# EAGLE design motherboard (EAGLE 6.4)
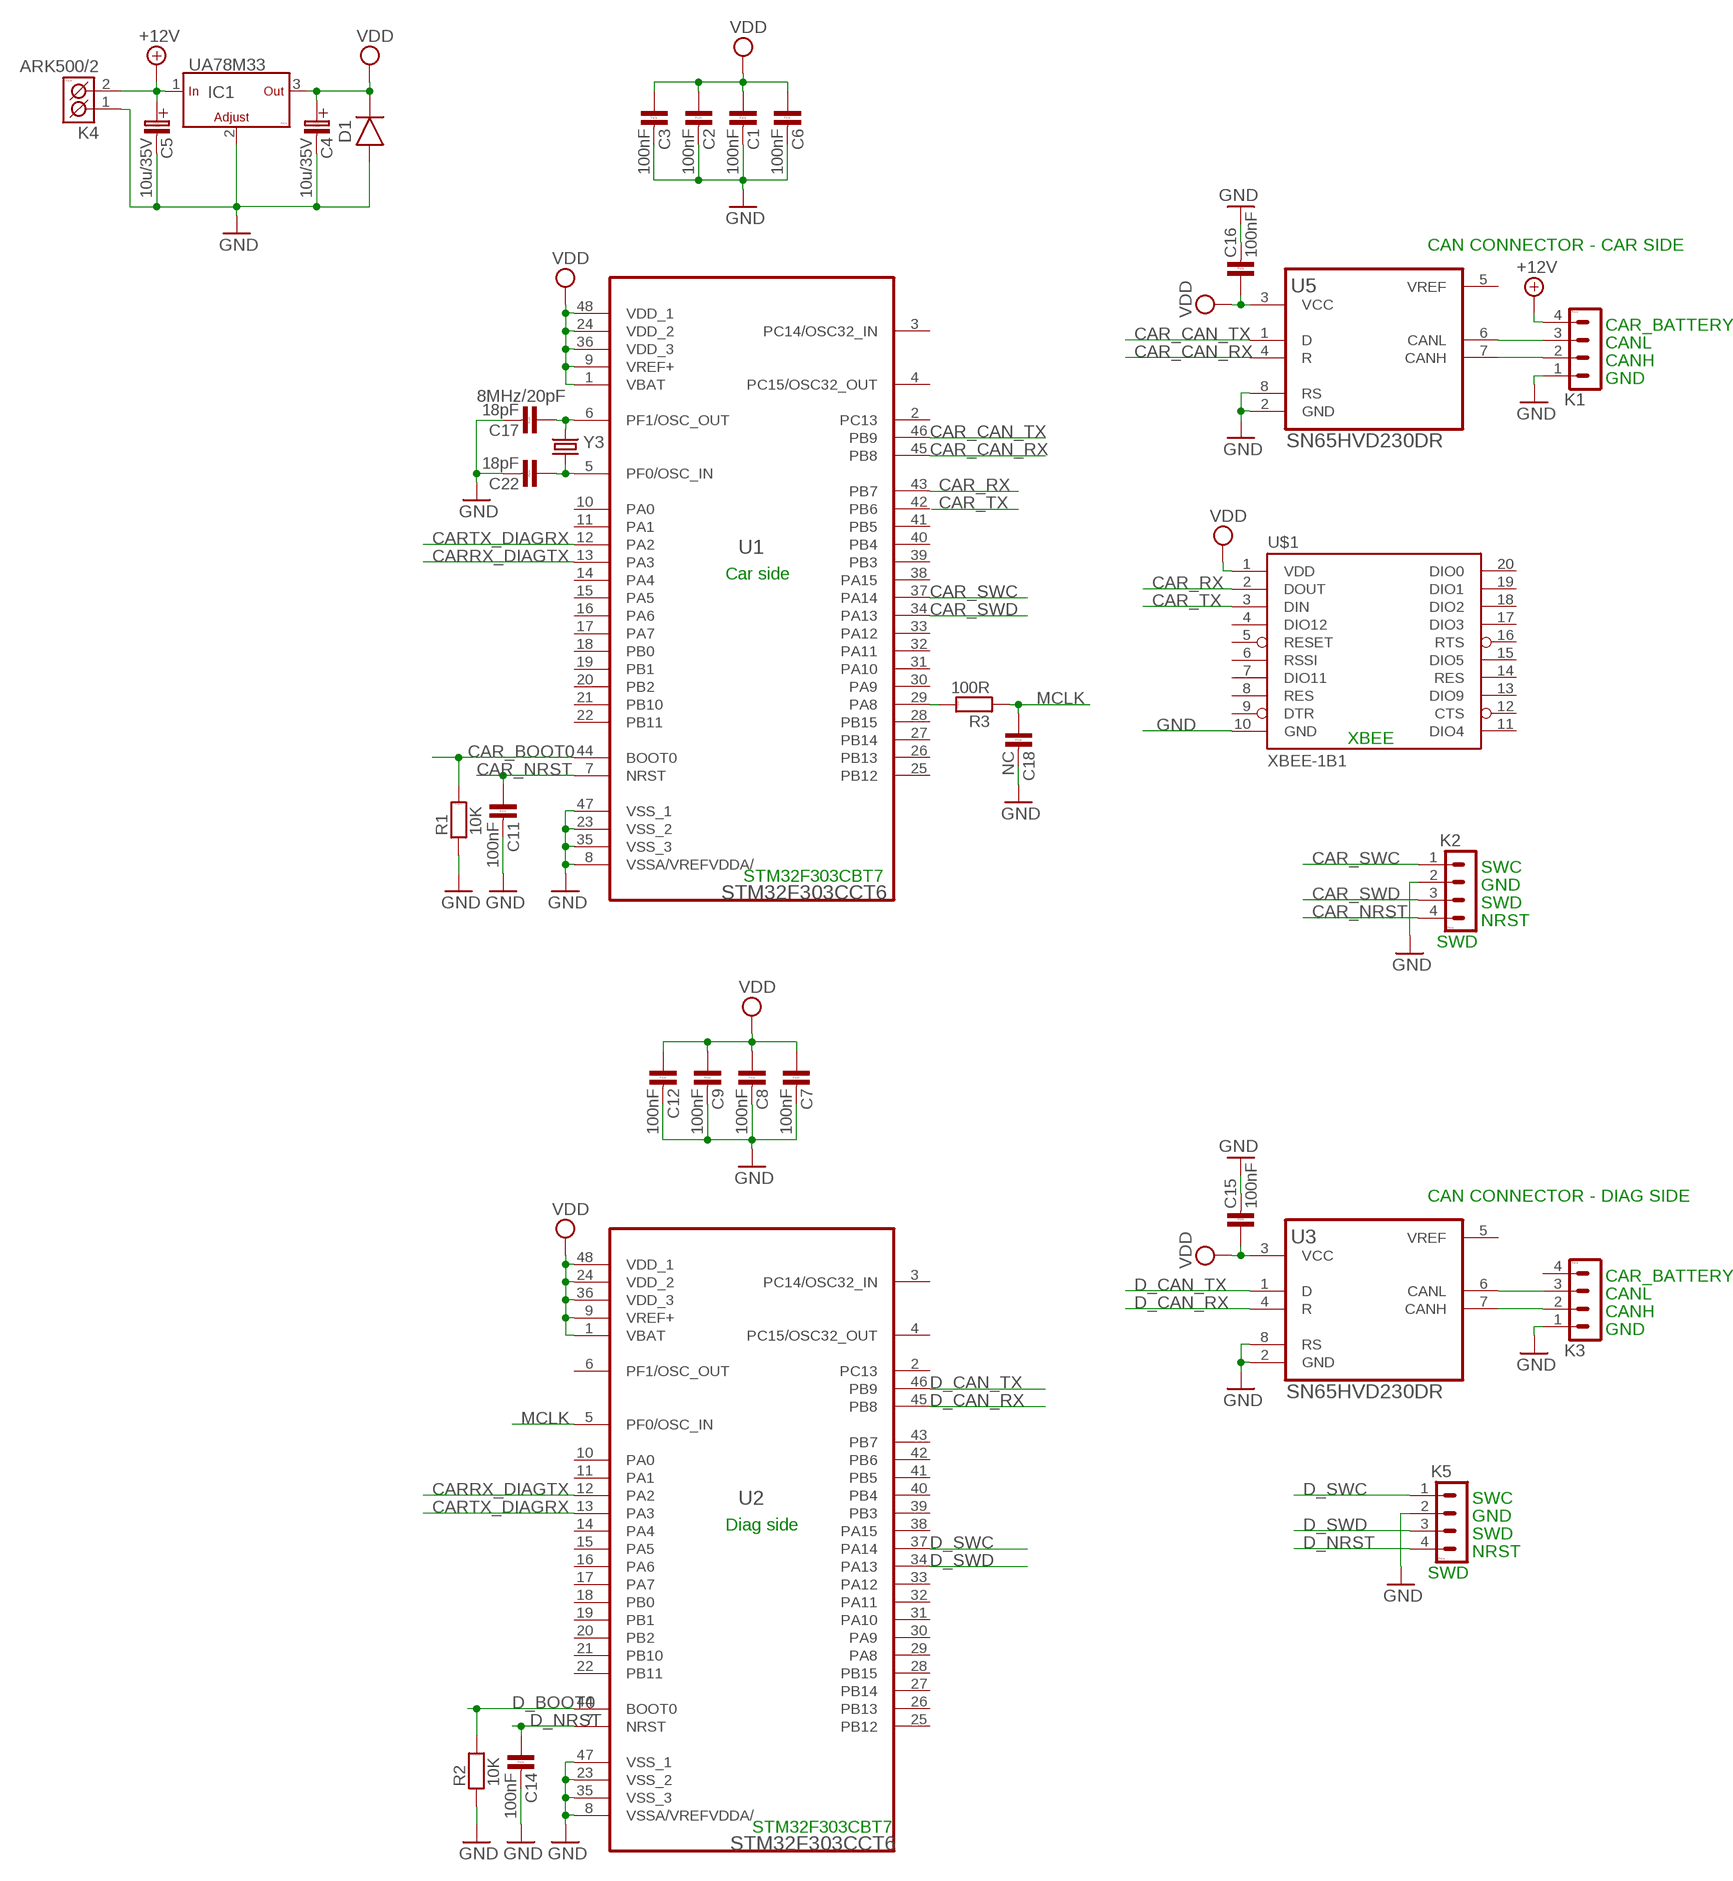
[diagram p0: schematic, sheet 1]

## Parts
C1  100nF  C-KERAMIK_SMD_0805  [0805]
C2  100nF  C-KERAMIK_SMD_0805  [0805]
C3  100nF  C-KERAMIK_SMD_0805  [0805]
C4  10u/35V  C-ELEKTROLYT_2,5  [C-EL_2,5]
C5  10u/35V  C-ELEKTROLYT_2,5  [C-EL_2,5]
C6  100nF  C-KERAMIK_SMD_0805  [0805]
C7  100nF  C-KERAMIK_SMD_0805  [0805]
C8  100nF  C-KERAMIK_SMD_0805  [0805]
C9  100nF  C-KERAMIK_SMD_0805  [0805]
C11  100nF  C-KERAMIK_SMD_0805  [0805]
C12  100nF  C-KERAMIK_SMD_0805  [0805]
C14  100nF  C-KERAMIK_SMD_0805  [0805]
C15  100nF  C-KERAMIK_SMD_0805  [0805]
C16  100nF  C-KERAMIK_SMD_0805  [0805]
C17  18pF  C-KERAMIK_SMD_1206  [1206]
C18  NC  C-KERAMIK_SMD_0805  [0805]
C22  18pF  C-KERAMIK_SMD_1206  [1206]
D1  1N4007SMD  [MELF]
IC1  UA78M33  [TO285P991X230-3N]
K1  PSH02-04P  [PSH02-04P]
K2  PSH02-04P  [PSH02-04P]
K3  PSH02-04P  [PSH02-04P]
K4  ARK500/2  [ARK500/2]
K5  PSH02-04P  [PSH02-04P]
R1  10K  R_SMD_0805  [0805]
R2  10K  R_SMD_0805  [0805]
R3  100R  R_SMD_0805  [0805]
U1  STM32F303CCT6  [QFP50P900X900X160-48N]
U2  STM32F303CCT6  [QFP50P900X900X160-48N]
U3  SN65HVD230DR  [SOIC127P600X175-8N]
U5  SN65HVD230DR  [SOIC127P600X175-8N]
U$1  XBEE-1B1  [XBEE-1]
Y3  8MHz/20pF  CRYSTALSMD  [HC49UP]

## Nets
+12V: C5.C+(C_EL+) IC1.1(IN) K1.4 K4.2(K2)
CAR_BOOT0: R1.2 U1.44(BOOT0)
CAR_CAN_RX: U1.45(PB8) U5.4(R)
CAR_CAN_TX: U1.46(PB9) U5.1(D)
CAR_NRST: C11.1 K2.4 U1.7(NRST)
CAR_RX: U1.43(PB7) U$1.2(DOUT)
CAR_SWC: K2.1 U1.37(PA14)
CAR_SWD: K2.3 U1.34(PA13)
CAR_TX: U$1.3(DIN)
CARRX_DIAGTX: U1.13(PA3) U2.12(PA2)
CARTX_DIAGRX: U1.12(PA2) U2.13(PA3)
D_BOOT0: R2.2 U2.44(BOOT0)
D_CAN_RX: U2.45(PB8) U3.4(R)
D_CAN_TX: U2.46(PB9) U3.1(D)
D_NRST: C14.1 K5.4 U2.7(NRST)
D_SWC: K5.1 U2.37(PA14)
D_SWD: K5.3 U2.34(PA13)
GND: C1.2 C2.2 C3.2 C4.C-(C_EL-) C5.C-(C_EL-) C6.2 C7.2 C8.2 C9.2 C11.2 C12.2 C14.2 C15.2 C16.2 C17.2 C18.2 C22.2 D1.A IC1.2(ADJ) K1.1 K2.2 K3.1 K4.1(K1) K5.2 R1.1 R2.1 U1.8(VSSA/VREFVDDA/) U1.23(VSS_2) U1.35(VSS_3) U1.47(VSS_1) U2.8(VSSA/VREFVDDA/) U2.23(VSS_2) U2.35(VSS_3) U2.47(VSS_1) U3.2(GND) U3.8(RS) U5.2(GND) U5.8(RS) U$1.10(GND)
MCLK: C18.1 R3.1 U2.5(PF0/OSC_IN)
N$1: K3.2 U3.7(CANH)
N$2: K3.3 U3.6(CANL)
N$3: R3.2 U1.29(PA8)
N$4: K1.2 U5.7(CANH)
N$5: K1.3 U5.6(CANL)
N$7: C17.1 U1.6(PF1/OSC_OUT) Y3.2
N$8: C22.1 U1.5(PF0/OSC_IN) Y3.1
VDD: C1.1 C2.1 C3.1 C4.C+(C_EL+) C6.1 C7.1 C8.1 C9.1 C12.1 C15.1 C16.1 D1.K IC1.3(OUT) U1.1(VBAT) U1.9(VREF+) U1.24(VDD_2) U1.36(VDD_3) U1.48(VDD_1) U2.1(VBAT) U2.9(VREF+) U2.24(VDD_2) U2.36(VDD_3) U2.48(VDD_1) U3.3(VCC) U5.3(VCC) U$1.1(VDD)
Unconnected: K3.4 U1.2(PC13) U1.3(PC14/OSC32_IN) U1.4(PC15/OSC32_OUT) U1.10(PA0) U1.11(PA1) U1.14(PA4) U1.15(PA5) U1.16(PA6) U1.17(PA7) U1.18(PB0) U1.19(PB1) U1.20(PB2) U1.21(PB10) U1.22(PB11) U1.25(PB12) U1.26(PB13) U1.27(PB14) U1.28(PB15) U1.30(PA9) U1.31(PA10) U1.32(PA11) U1.33(PA12) U1.38(PA15) U1.39(PB3) U1.40(PB4) U1.41(PB5) U1.42(PB6) U2.2(PC13) U2.3(PC14/OSC32_IN) U2.4(PC15/OSC32_OUT) U2.6(PF1/OSC_OUT) U2.10(PA0) U2.11(PA1) U2.14(PA4) U2.15(PA5) U2.16(PA6) U2.17(PA7) U2.18(PB0) U2.19(PB1) U2.20(PB2) U2.21(PB10) U2.22(PB11) U2.25(PB12) U2.26(PB13) U2.27(PB14) U2.28(PB15) U2.29(PA8) U2.30(PA9) U2.31(PA10) U2.32(PA11) U2.33(PA12) U2.38(PA15) U2.39(PB3) U2.40(PB4) U2.41(PB5) U2.42(PB6) U2.43(PB7) U3.5(VREF) U5.5(VREF) U$1.4(DIO12) U$1.5(RESET) U$1.6(RSSI) U$1.7(DIO11) U$1.8(RES) U$1.9(DTR) U$1.11(DIO4) U$1.12(CTS) U$1.13(DIO9) U$1.14(RES) U$1.15(DIO5) U$1.16(RTS) U$1.17(DIO3) U$1.18(DIO2) U$1.19(DIO1) U$1.20(DIO0)

## Notes on the sheet
- CAN CONNECTOR - CAR SIDE
- CAR_BATTERY
- CANL
- CANH
- GND
- Car side
- XBEE
- SWC
- STM32F303CBT7
- GND
- SWD
- NRST
- SWD
- CAN CONNECTOR - DIAG SIDE
- CAR_BATTERY
- CANL
- CANH
- GND
- SWC
- GND
- Diag side
- SWD
- NRST
- SWD
- STM32F303CBT7

## Library data of the parts
C1-C3 C6-C9 C11 C12 C14-C18 C22 = #PaJa_30:C-KERAMIK: Kondenzator - keramicky
C4 C5 = #PaJa_30:C-ELEKTROLYT: Kondenzator - elektrolyticky
D1 = #_GM99:1N4007SMD
IC1 = !moje_Sobriety:UA78M33: IC, POSITIVE-VOLTAGE REGULATORS, 3.3V, 3-TO-252; MPN: UA78M33CKVURG3; OC_FARNELL: 2075446; OC_NEWARK: 80K3502; PACKAGE: 3-TO-252; SUPPLIER: TEXAS INSTRUMENTS
K1-K3 K5 = #PaJa_konektory:PSH02-04: Konektory se zamkem - vidlice - 4pin
K4 = #PaJa_konektory:ARK500/2: Svorkovnice - roztec 5mm - dvojita
R1-R3 = #PaJa_30:R: Rezistor
U1 U2 = !moje_Sobriety:STM32F303CCT6: MCU, 32BIT, CORTEX M4, 48LQFP; MPN: STM32F303CCT6; OC_FARNELL: 2215113; OC_NEWARK: 46W2192; PACKAGE: 48LQFP; SUPPLIER: STMicroelectronics
U3 U5 = !moje_Sobriety:SN65HVD230DR: 3.3-V CAN TRANSCEIVERS; MPN: SN65HVD230DR; OC_FARNELL: 8452148; OC_NEWARK: 75C7745; PACKAGE: SOIC-8; SUPPLIER: Texas Instruments
U$1 = SparkFun:XBEE-1
Y3 = SparkFun:CRYSTAL: Crystals Various standard crystals. Proven footprints. Spark Fun Electronics SKU : COM-00534

## Board
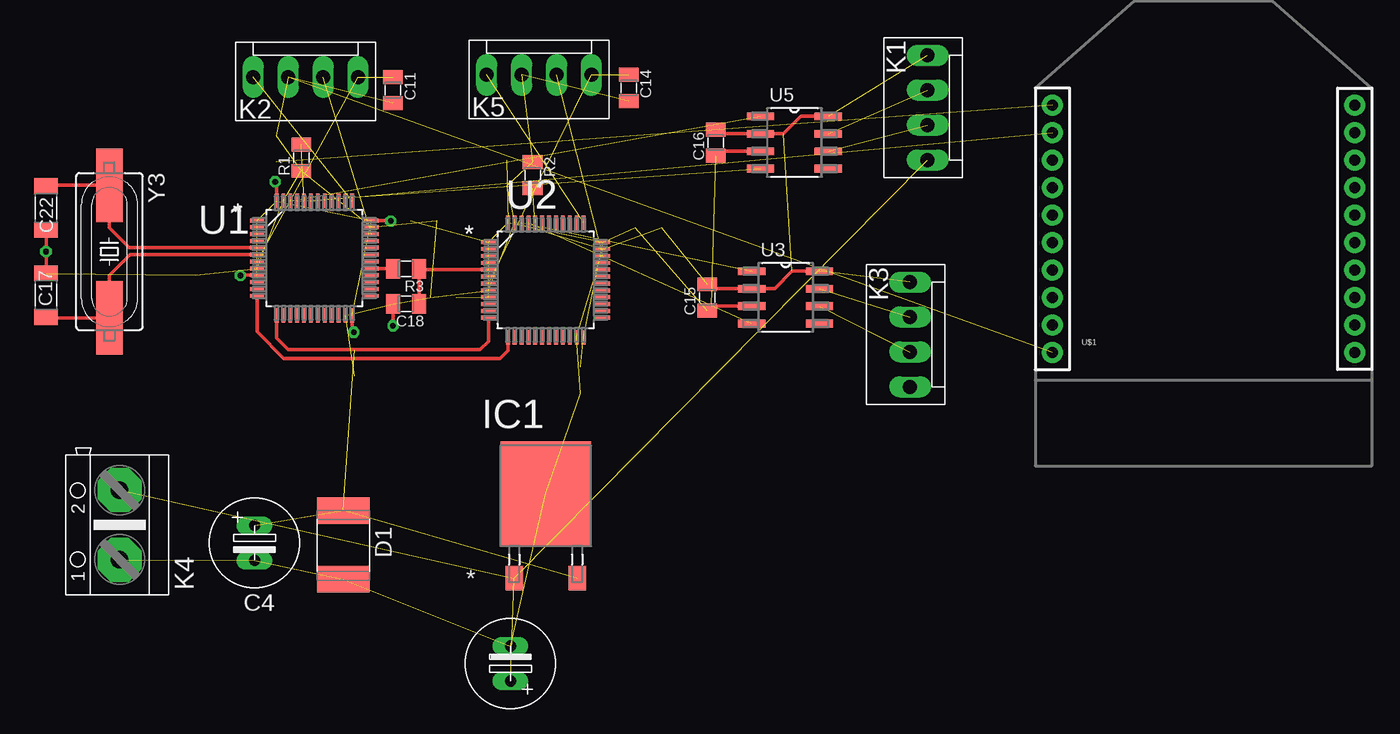
[diagram p1: board, top side]
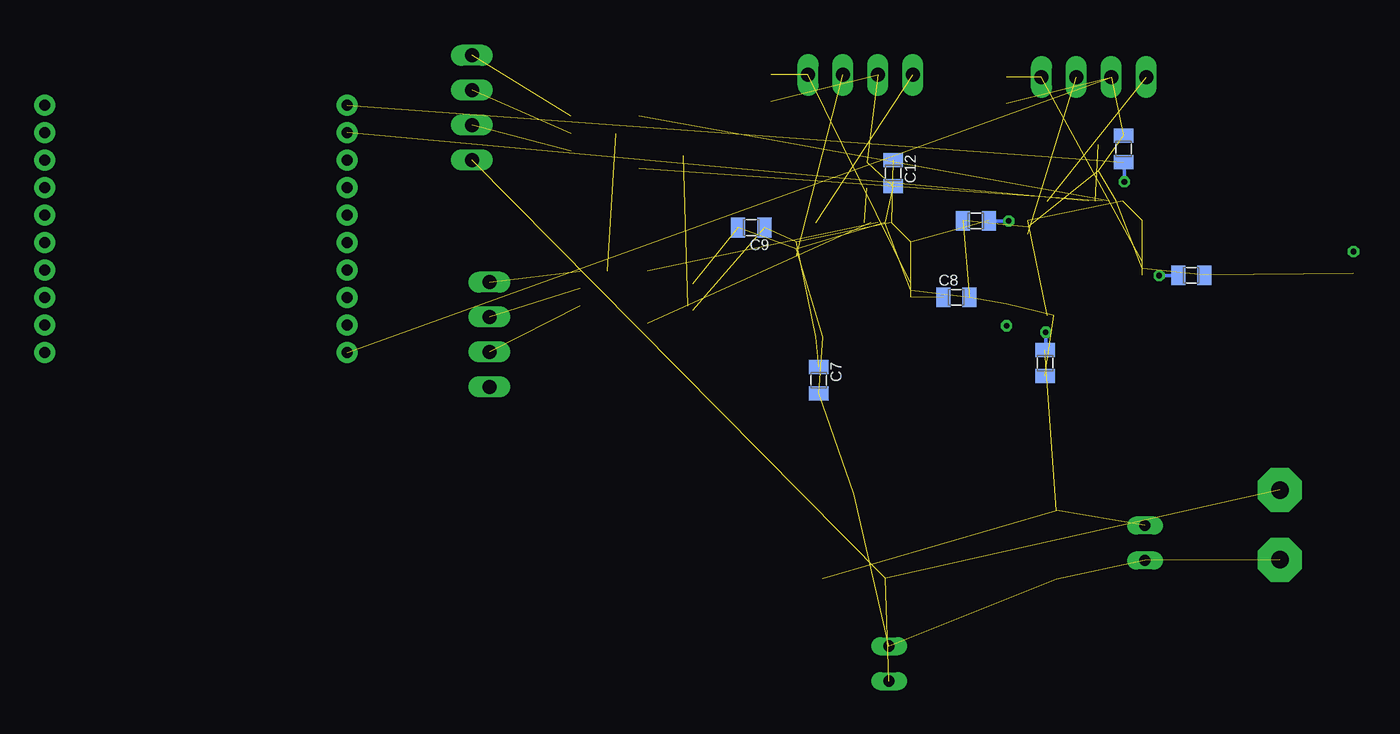
[diagram p2: board, bottom side, seen from below]

No outline drawn. Coordinates in mm, seen from the top.
Copper layers (1*16): Top 0.035mm / dielectric 1.5mm / Bottom 0.035mm
Design rules "default *": minimum track width 10mil, minimum drill 20mil, track to track 8mil, track to pad 8mil, pad to pad 8mil, via to via 8mil, smd to smd 8mil, copper to edge 40mil, drill to drill 8mil, minimum pad ring 10mil, minimum via ring 8mil, stop-mask expansion 4mil, vias tented up to drill 0mil, thermal gap 10mil

### Footprints (pad centres in the part's own frame; a part is rotated, then mirrored left to right if it is on the bottom)
0805 = smd 1.016 x 1.422: 1 -0.953,0; 2 0.953,0
C-EL_2,5 = drill 0.813 pad 1.27 long: C+ -1.27,0; C- 1.27,0
1206 = smd 1.143 x 1.702: 1 -1.587,0; 2 1.587,0
MELF = smd 1.93 x 3.81: A 2.46,0; K -2.54,0
TO285P991X230-3N = smd 1.27 x 1.778: 1 -2.286,-5.994; 3 2.286,-5.994 | smd 6.579 x 7.595: 2 0,0.152
PSH02-04P = drill 1.016 pad 1.422 long: 1 -3.81,0; 2 -1.27,0; 3 1.27,0; 4 3.81,0
ARK500/2 = drill 1.27 pad 3.2 octagon: 1 -2.54,0; 2 2.54,0
QFP50P900X900X160-48N = smd 1.041 x 0.279: 1 -4.166,2.743; 2 -4.166,2.261; 3 -4.166,1.753; 4 -4.166,1.245; 5 -4.166,0.762; 6 -4.166,0.254; 7 -4.166,-0.254; 8 -4.166,-0.762; 9 -4.166,-1.245; 10 -4.166,-1.753; 11 -4.166,-2.261; 12 -4.166,-2.743; 25 4.166,-2.743; 26 4.166,-2.261; 27 4.166,-1.753; 28 4.166,-1.245; 29 4.166,-0.762; 30 4.166,-0.254; 31 4.166,0.254; 32 4.166,0.762; 33 4.166,1.245; 34 4.166,1.753; 35 4.166,2.261; 36 4.166,2.743 | smd 0.279 x 1.041: 13 -2.743,-4.166; 14 -2.261,-4.166; 15 -1.753,-4.166; 16 -1.245,-4.166; 17 -0.762,-4.166; 18 -0.254,-4.166; 19 0.254,-4.166; 20 0.762,-4.166; 21 1.245,-4.166; 22 1.753,-4.166; 23 2.261,-4.166; 24 2.743,-4.166; 37 2.743,4.166; 38 2.261,4.166; 39 1.753,4.166; 40 1.245,4.166; 41 0.762,4.166; 42 0.254,4.166; 43 -0.254,4.166; 44 -0.762,4.166; 45 -1.245,4.166; 46 -1.753,4.166; 47 -2.261,4.166; 48 -2.743,4.166
SOIC127P600X175-8N = smd 1.981 x 0.559: 1 -2.464,1.905; 2 -2.464,0.635; 3 -2.464,-0.635; 4 -2.464,-1.905; 5 2.464,-1.905; 6 2.464,-0.635; 7 2.464,0.635; 8 2.464,1.905
XBEE-1 = drill 0.8 pad 1.524: 1 -11,20; 2 -11,18; 3 -11,16; 4 -11,14; 5 -11,12; 6 -11,10; 7 -11,8; 8 -11,6; 9 -11,4; 10 -11,2; 11 11,2; 12 11,4; 13 11,6; 14 11,8; 15 11,10; 16 11,12; 17 11,14; 18 11,16; 19 11,18; 20 11,20
HC49UP = smd 5.334 x 1.93: 1 -4.826,0; 2 4.826,0

### Placement (x,y rotation side)
C1  19.12,40.81 90 bottom
C2  24.82,25.23 270 bottom
C3  29.86,35.59 180 bottom
C4  17.55,12.13 270 top
C5  36.17,3.35 90 top
C6  14.18,31.63 0 bottom
C7  41.27,23.97 270 bottom
C8  31.27,30 0 bottom
C9  46.2,35.08 180 bottom
C11  27.62,45.09 270 top
C12  35.88,39.05 270 bottom
C14  44.77,45.24 270 top
C15  50.48,30 90 top
C16  51.12,41.27 90 top
C17  2.38,30.16 90 top
C18  28.57,29.53 180 top
C22  2.38,36.51 270 top
D1  24.01,11.95 270 top
IC1  38.73,15.56 0 top
K1  66.52,43.81 270 top
K2  21.27,46.04 0 top
K3  65.25,27.3 270 top
K4  7.74,13.45 90 top
K5  38.26,46.2 0 top
R1  20.95,40.16 90 top
R2  37.78,38.89 270 top
R3  28.57,32.07 180 top
U1  21.91,32.86 0 top
U2  38.73,31.27 0 top
U3  56.2,30 0 top
U5  56.83,41.27 0 top
U$1  86.6,23.99 0 top
Y3  6.99,33.34 270 top

### Tracks (layer width: path | path; a pad name or v marks a point on that pad's centre or on a via)
+12V  (3 unrouted)
CAR_BOOT0  (1 unrouted)
CAR_CAN_RX  (1 unrouted)
CAR_CAN_TX  (1 unrouted)
CAR_NRST  (2 unrouted)
CAR_RX  (1 unrouted)
CAR_SWC  (1 unrouted)
CAR_SWD  (1 unrouted)
CARRX_DIAGTX
  Top 0.254: U1.13 19.16,27.03 20,26.19 33.97,26.19 34.57,26.79 U2.12
CARTX_DIAGRX
  Top 0.254: U1.12 17.74,27.5 19.68,25.56 35.4,25.56 35.99,26.15 U2.13
D_BOOT0  (1 unrouted)
D_CAN_RX  (1 unrouted)
D_CAN_TX  (1 unrouted)
D_NRST  (2 unrouted)
D_SWC  (1 unrouted)
D_SWD  (1 unrouted)
GND  (via drill 0.41)  (33 unrouted)
  Top 0.254: C22.2 v2.38,33.34 C17.2 | C18.2 v27.62,27.94 | C15.2 50.8,30.64 U3.2 55.4,30.64 56.67,31.91 U3.8 | U5.8 57.31,43.18 56.04,41.91 U5.2 51.44,41.91 C16.2
MCLK
  Top 0.254: C18.1 R3.1 29.56,32.04 U2.5
N$1  (1 unrouted)
N$2  (1 unrouted)
N$3
  Top 0.254: U1.29 27.59,32.1 R3.2
N$4  (1 unrouted)
N$5  (1 unrouted)
N$7
  Top 0.254: U1.6 8.51,33.12 6.99,31.59 Y3.2 2.44,28.51 C17.1
N$8
  Top 0.254: U1.5 8.45,33.62 6.99,35.08 Y3.1 2.44,38.16 C22.1
VDD  (via drill 0.41)  (19 unrouted)
  Top 0.254: U1.36 27.26,35.6 v27.46,35.56 | U1.48 19.16,38.3 v19.05,38.42 | U1.24 24.65,27.58 v24.77,27.46 | U1.9 16.38,31.62 v16.51,31.59 | U3.3 50.8,29.37 C15.1 | U5.3 51.44,40.64 C16.1
  Bottom 0.254: v27.46,35.56 28.57,35.56 C3.1 | v19.05,38.42 19.05,39.63 C1.1 | v24.77,27.46 24.77,26.24 C2.1 | v16.51,31.59 15.17,31.59 C6.1